# EAGLE board Kopie von JKW_standalone (EAGLE 5.10)
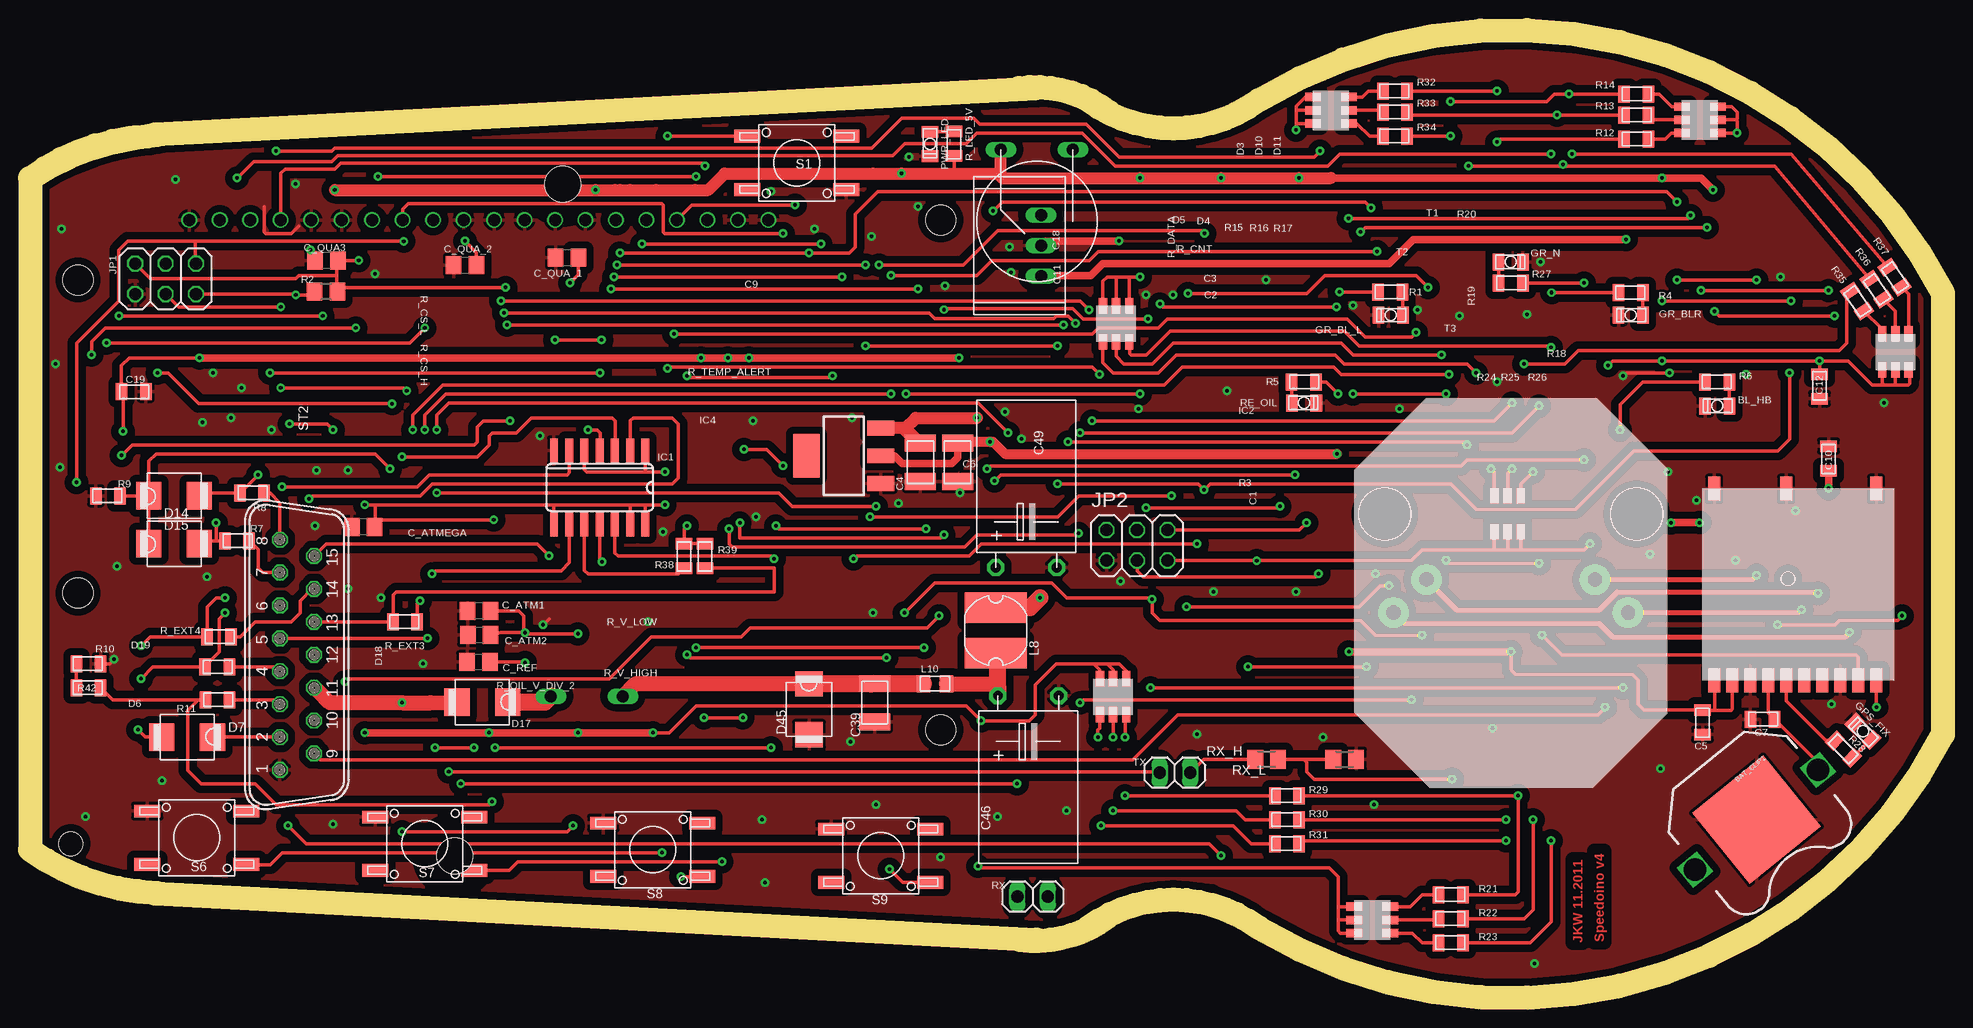
[diagram p2: board, top side]
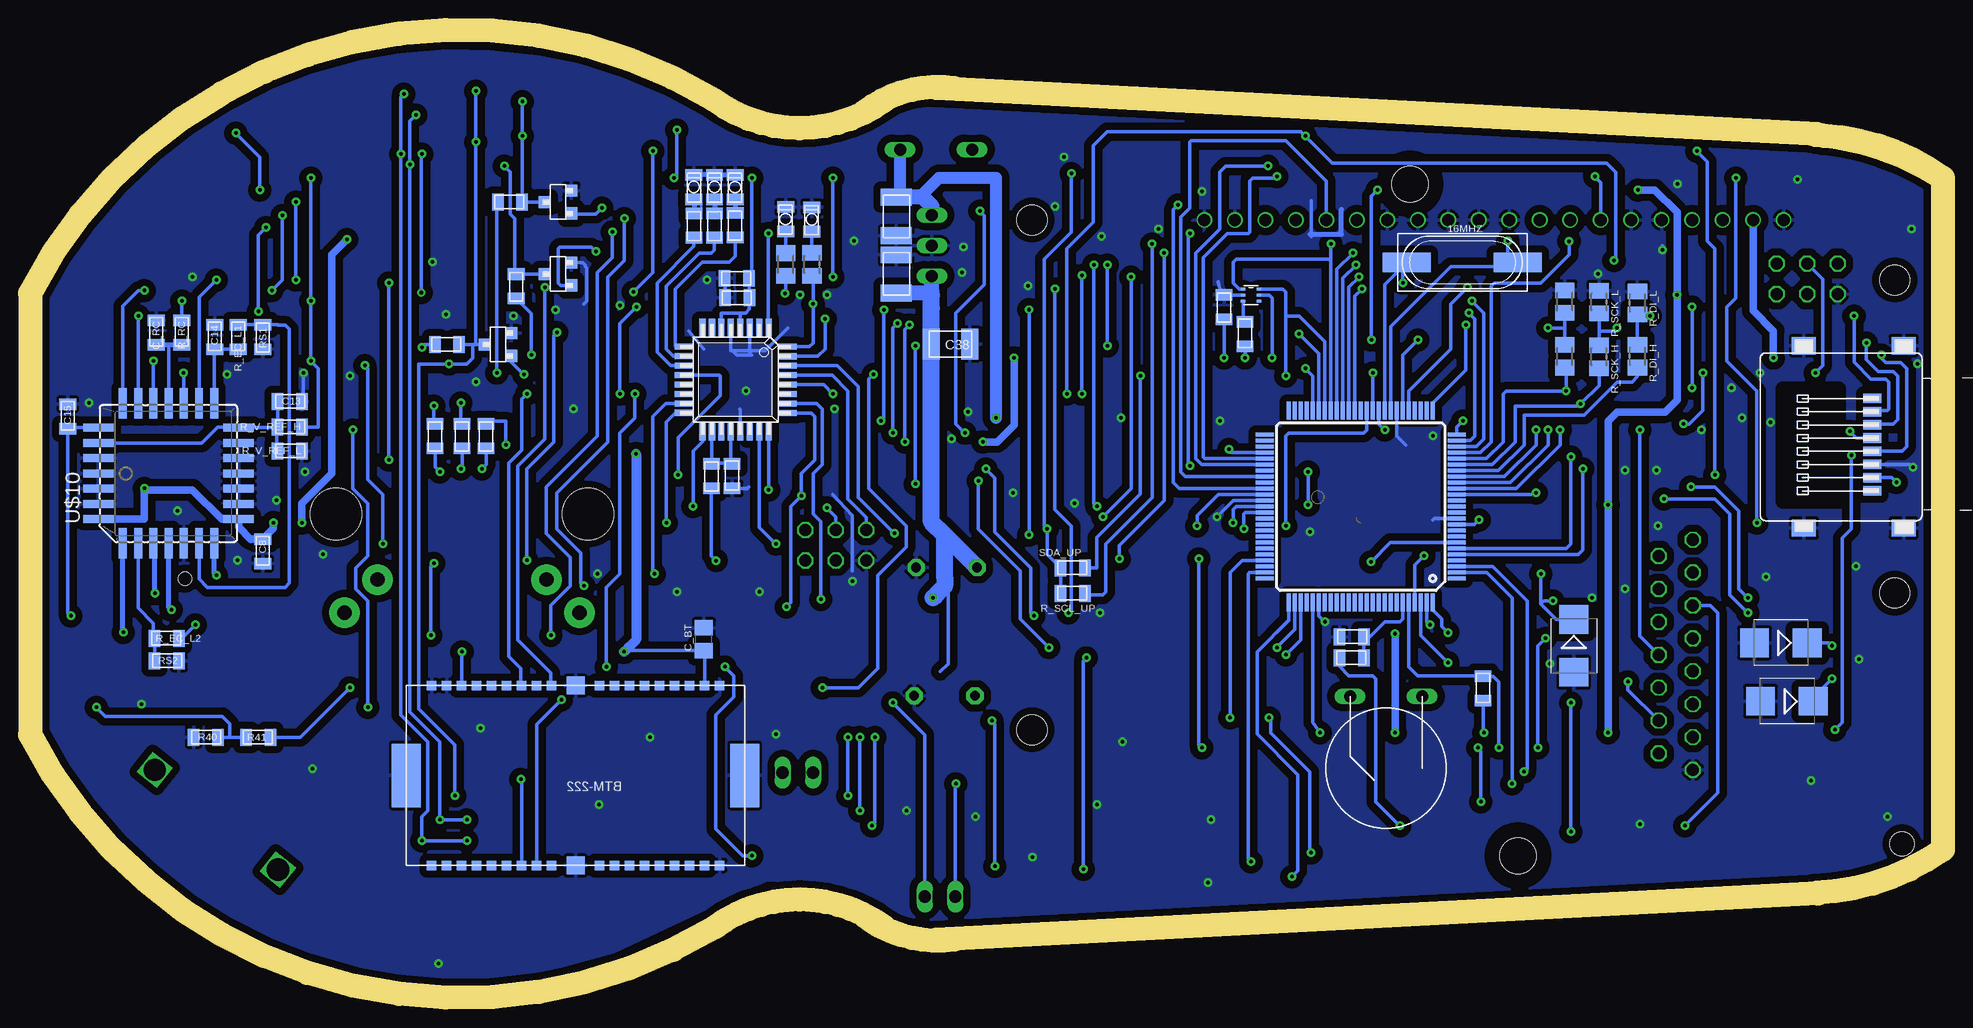
[diagram p3: board, bottom side, seen from below]

Size 159.4 x 80.69 mm. Coordinates in mm from the lower left corner, seen from the top.
Outline: 10.4,71.98 83.86,75.83
Outline: 0,68.34 arc-29 10.6,71.94
Outline: 10.4,8.7 83.86,4.85
Outline: 0,68.34 0,12.34 arc33 10.6,8.74
Outline: 0,68.34 arc-33 9.9,71.84
Outline: 82.4,75.84 arc-45 89.9,73.84
Outline: 88.15,74.84 arc73 102.4,74.84 arc-94 159.4,58.74 159.4,21.94 arc-94 102.4,5.84 arc73 88.15,5.84
Outline: 82.4,4.84 arc45 89.9,6.84
Copper layers (1*16): Top 0.035mm / dielectric 1.5mm / Bottom 0.035mm
Design rules "ZWILLING *": minimum track width 0.2mm, minimum drill 8mil, track to track 0.15mm, track to pad 0.15mm, pad to pad 0.15mm, via to via 0.15mm, smd to smd 0mil, copper to edge 0.15mm, drill to drill 0.15mm, minimum pad ring 0.15mm, minimum via ring 0.2mm, stop-mask expansion 0.1mm, vias tented up to drill 0mil, thermal gap 10mil
Net classes: 0 default: width 0.203 mm, drill 0.406 mm, clearance 0.203 mm; 1 power: width 0.61 mm, drill 0.711 mm, clearance 0.203 mm; 2 gnd: width 0.305 mm, drill 0.711 mm, clearance 0.203 mm; 3 usbvcc: width 0.508 mm, drill 0.711 mm, clearance 0.203 mm
Holes 3 mm at -94.6,24.84 -94.1,69.84 35.4,11.84 44.4,67.84
Holes 2 mm at 3.4,12.84
tRestrict: area -97.4,22 to -91.8,27.6; area -96.9,67 to -91.3,72.6; area 32.6,9 to 38.2,14.6; area 41.6,65 to 47.2,70.6
bRestrict: area -96.6,22.8 to -92.6,26.8; area -96.1,67.8 to -92.1,71.8; area 33.4,9.8 to 37.4,13.8; area 42.4,65.8 to 46.4,69.8

## Footprints (pad centres in the part's own frame; a part is rotated, then mirrored left to right if it is on the bottom)
POLY_FUSE = drill 1 long: P$1 -3,0; P$2 3,0
XT-HC49S-SMD = smd 4 x 1.6: 1 -4.617,0; 2 4.617,0
RGB_LED = smd 1.3 x 0.7: B+ 0,0.55; B- 3,0.55; G+ 0,1.65; G- 3,1.65; R+ 0,2.75; R- 3,2.75
BATTCON_12MM_PTH = smd 7.62 x 7.62: GND 0,0 | drill 1.854 square: VCC@1 -6.604,0; VCC@2 6.604,0
LED-0805 = smd 0.965 x 1.397: 1 -1.016,0; 2 1.016,0
BTM-222 = smd 0.8 x 0.8: P$1 -12.635,-7.5; P$2 -11.385,-7.5; P$3 -10.135,-7.5; P$4 -8.885,-7.5; P$5 -7.635,-7.5; P$6 -6.385,-7.5; P$7 -5.135,-7.5; P$8 -3.885,-7.5; P$9 -2.635,-7.5; P$11 1.365,-7.5; P$12 2.615,-7.5; P$13 3.865,-7.5; P$14 5.115,-7.5; P$15 6.365,-7.5; P$16 7.615,-7.5; P$17 8.865,-7.5; P$18 10.115,-7.5; P$19 11.365,-7.5; P$20 11.365,7.5; P$21 10.115,7.5; P$22 8.865,7.5; P$23 7.615,7.5; P$24 6.365,7.5; P$25 5.115,7.5; P$26 3.865,7.5; P$27 2.615,7.5; P$28 1.365,7.5; P$30 -2.635,7.5; P$31 -3.885,7.5; P$32 -5.135,7.5; P$33 -6.385,7.5; P$34 -7.635,7.5; P$35 -8.885,7.5; P$36 -10.135,7.5; P$37 -11.385,7.5; P$38 -12.635,7.5 | smd 1.5 x 1.5: P$10 -0.635,-7.5; P$29 -0.635,7.5 | smd 2.4 x 5.3: P$AGND -14.735,0; P$BGND 13.465,0
0805 = smd 0.965 x 1.397: 1 -1.016,0; 2 1.016,0
1210 = smd 1.397 x 2.591: 1 -1.6,0; 2 1.6,0
EL-5-8X13R = drill 0.8 pad 1.422 octagon: 1 0,2.54; 2 0,-2.54
EL-5-8X13 = drill 0.8 pad 1.422 octagon: 1 0,-2.54; 2 0,2.54
C0805 = smd 1.3 x 1.5: 1 -0.95,0; 2 0.95,0
SMB = smd 2.4 x 2.4: A 2.2,0; C -2.2,0
SMB' = smd 2.1 x 2.3: A -2.114,0; K 2.114,0
SOT223 = smd 1.219 x 2.235: 1 -2.311,-3.099; 2 0,-3.099; 3 2.311,-3.099 | smd 3.6 x 2.2: 4 0,3.099
MT3329 = smd 2 x 1: 3D-FIX -8.5,0.15; D+ -8.5,-1.35; D- -8.5,-2.85; EN -8.5,4.65; GND -8.5,3.15; GND2 -8.5,-4.35; GND_3 7.5,6.15; GND_4 7.5,0.15; GND_5 7.5,-7.35; RXD -8.5,-7.35; TXD -8.5,-5.85; VBACKUP -8.5,1.65; VCC -8.5,6.15 | hole 1.1: 0,0
SO14 = smd 0.66 x 2.032: 1 -3.81,-3.073; 2 -2.54,-3.073; 3 -1.27,-3.073; 4 0,-3.073; 5 1.27,-3.073; 6 2.54,-3.073; 7 3.81,-3.073; 8 3.81,3.073; 9 2.54,3.073; 10 1.27,3.073; 11 0,3.073; 12 -1.27,3.073; 13 -2.54,3.073; 14 -3.81,3.073
TQFP-32_7X7 = smd 0.508 x 1.5: 1 -2.756,-4.331; 2 -1.968,-4.331; 3 -1.181,-4.331; 4 -0.394,-4.331; 5 0.394,-4.331; 6 1.181,-4.331; 7 1.968,-4.331; 8 2.756,-4.331; 17 2.756,4.331; 18 1.968,4.331; 19 1.181,4.331; 20 0.394,4.331; 21 -0.394,4.331; 22 -1.181,4.331; 23 -1.968,4.331; 24 -2.756,4.331 | smd 1.5 x 0.508: 9 4.331,-2.756; 10 4.331,-1.968; 11 4.331,-1.181; 12 4.331,-0.394; 13 4.331,0.394; 14 4.331,1.181; 15 4.331,1.968; 16 4.331,2.756; 25 -4.331,2.768; 26 -4.331,1.981; 27 -4.331,1.194; 28 -4.331,0.406; 29 -4.331,-0.381; 30 -4.331,-1.169; 31 -4.331,-1.956; 32 -4.331,-2.756
TQFP100 = smd 1.5 x 0.35: 1 -8,6; 2 -8,5.5; 3 -8,5; 4 -8,4.5; 5 -8,4; 6 -8,3.5; 7 -8,3; 8 -8,2.5; 9 -8,2; 10 -8,1.5; 11 -8,1; 12 -8,0.5; 13 -8,0; 14 -8,-0.5; 15 -8,-1; 16 -8,-1.5; 17 -8,-2; 18 -8,-2.5; 19 -8,-3; 20 -8,-3.5; 21 -8,-4; 22 -8,-4.5; 23 -8,-5; 24 -8,-5.5; 25 -8,-6; 51 8,-6; 52 8,-5.5; 53 8,-5; 54 8,-4.5; 55 8,-4; 56 8,-3.5; 57 8,-3; 58 8,-2.5; 59 8,-2; 60 8,-1.5; 61 8,-1; 62 8,-0.5; 63 8,0; 64 8,0.5; 65 8,1; 66 8,1.5; 67 8,2; 68 8,2.5; 69 8,3; 70 8,3.5; 71 8,4; 72 8,4.5; 73 8,5; 74 8,5.5; 75 8,6 | smd 0.35 x 1.5: 26 -6,-8; 27 -5.5,-8; 28 -5,-8; 29 -4.5,-8; 30 -4,-8; 31 -3.5,-8; 32 -3,-8; 33 -2.5,-8; 34 -2,-8; 35 -1.5,-8; 36 -1,-8; 37 -0.5,-8; 38 0,-8; 39 0.5,-8; 40 1,-8; 41 1.5,-8; 42 2,-8; 43 2.5,-8; 44 3,-8; 45 3.5,-8; 46 4,-8; 47 4.5,-8; 48 5,-8; 49 5.5,-8; 50 6,-8; 76 6,8; 77 5.5,8; 78 5,8; 79 4.5,8; 80 4,8; 81 3.5,8; 82 3,8; 83 2.5,8; 84 2,8; 85 1.5,8; 86 1,8; 87 0.5,8; 88 0,8; 89 -0.5,8; 90 -1,8; 91 -1.5,8; 92 -2,8; 93 -2.5,8; 94 -3,8; 95 -3.5,8; 96 -4,8; 97 -4.5,8; 98 -5,8; 99 -5.5,8; 100 -6,8
2X03 = drill 1.016 octagon: 1 -2.54,-1.27; 2 -2.54,1.27; 3 0,-1.27; 4 0,1.27; 5 2.54,-1.27; 6 2.54,1.27
L-PD54 = smd 2.54 x 5.2: 1 -1.905,0; 2 1.905,0
0805+603 = smd 1.11 x 1.43: 1 -0.953,0; 2 0.953,0
NHD_2.7 = drill 1 round: P$1 -110.13,24.5; P$2 -107.59,24.5; P$3 -105.05,24.5; P$4 -102.51,24.5; P$5 -99.97,24.5; P$6 -97.43,24.5; P$7 -94.89,24.5; P$8 -92.35,24.5; P$9 -89.81,24.5; P$10 -87.27,24.5; P$11 -84.73,24.5; P$12 -82.19,24.5; P$13 -79.65,24.5; P$14 -77.11,24.5; P$15 -74.57,24.5; P$16 -72.03,24.5; P$17 -69.49,24.5; P$18 -66.95,24.5; P$19 -64.41,24.5; P$20 -61.87,24.5 | hole 2.5: -119.4,19.5; -119.4,-6.6; -47.5,-18; -47.5,24.5
R0805 = smd 1.3 x 1.5: 1 -0.95,0; 2 0.95,0
M0805 = smd 1.3 x 1.6: 1 -0.95,0; 2 0.95,0
1X02 = drill 1.016 long: 1 -1.27,0; 2 1.27,0
SW-ECO = smd 2.184 x 1.067: 1 -4.128,2.223; 2 -4.128,-2.223; 3 4.128,2.223; 4 4.128,-2.223
SD_MICRO = smd 0.8 x 1.5: 1 3.2,-9.35; 2 2.1,-9.35; 3 1,-9.35; 4 -0.1,-9.35; 5 -1.2,-9.35; 6 -2.3,-9.35; 7 -3.4,-9.35; 8 -4.5,-9.35 | smd 1.45 x 2: GND 7.6,-11.95; GND2 7.6,-3.65; GND3 -7.6,-11.95; GND4 -7.6,-3.65
SOT-23 = smd 1.016 x 1.016: 1 0.953,1.111; 2 -0.952,1.111; 3 0,-1.111
SOT563 = smd 0.25 x 0.4: 1 -0.5,-0.66; 2 0,-0.66; 3 0.5,-0.66; 4 0.5,0.66; 5 0,0.66; 6 -0.5,0.67
SIP3 = drill 1 long: GND 5.75,2; IN 3.21,2; OUT 8.29,2
STEPPER = drill 1.2 pad 2.54 round: 1+ 5.47,7.03; 1- 8.23,9.785; 2+ 8.23,-9.785; 2- 5.47,-7.03 | hole 4.3: 0,10.5; 0,-10.5
PLCC28 = smd 0.66 x 2.54: 1 0,4.572; 2 -1.27,4.572; 3 -2.54,4.572; 4 -3.81,4.572; 12 -3.81,-7.112; 13 -2.54,-7.112; 14 -1.27,-7.112; 15 0,-7.112; 16 1.27,-7.112; 17 2.54,-7.112; 18 3.81,-7.112; 26 3.81,4.572; 27 2.54,4.572; 28 1.27,4.572 | smd 2.54 x 0.66: 5 -5.842,2.54; 6 -5.842,1.27; 7 -5.842,0; 8 -5.842,-1.27; 9 -5.842,-2.54; 10 -5.842,-3.81; 11 -5.842,-5.08; 19 5.842,-5.08; 20 5.842,-3.81; 21 5.842,-2.54; 22 5.842,-1.27; 23 5.842,0; 24 5.842,1.27; 25 5.842,2.54
IP67-SUB-D = drill 1.016 octagon: 1 -9.601,1.422; 2 -6.858,1.422; 3 -4.115,1.422; 4 -1.372,1.422; 5 1.372,1.422; 6 4.115,1.422; 7 6.858,1.422; 8 9.601,1.422; 9 -8.23,-1.422; 10 -5.486,-1.422; 11 -2.743,-1.422; 12 0,-1.422; 13 2.743,-1.422; 14 5.486,-1.422; 15 8.23,-1.422

## Placement (x,y rotation side)
5V_F  600mA  [POLY_FUSE]  83.9,70.72 180 top
12V_F1  1.1A  [POLY_FUSE]  46.4,25.14 180 bottom
16MHZ  16Mhz  [XT-HC49S-SMD]  40.04,61.31 0 bottom
18632422  RGB_LED  [RGB_LED]  88.85,57.69 270 top
BAT_CLIP1  F_908642  [BATTCON_12MM_PTH]  143.88,14.84 219 top
BL_HB  HighB _ 645-598-8191-107F  [LED-0805]  140.6,49.34 180 top
BLUETOOTH  BTM-222  [BTM-222]  114.57,18.53 180 bottom
C1  100nF  [0805]  100.9,43.49 270 bottom
C2  100nF  [0805]  100.46,58.36 0 bottom
C3  100nF  [0805]  100.5,59.98 0 bottom
C4  100n/20V  [1210]  74.2,44.64 90 top
C5  100nF  [0805]  139.38,22.97 90 top
C6  10u/20V  [1210]  77.3,44.64 90 top
C7  100nF  [0805]  144.38,23.22 180 top
C8  100nF  [0805]  140,37.22 270 bottom
C9  100nF  [0805]  59.9,57.59 90 bottom
C10  10µF  [0805]  149.88,44.97 90 top
C11  100n/20V  [1210]  87.2,60.34 90 bottom
C12  100nF  [0805]  149.12,50.97 270 top
C13  100nF  [0805]  137.75,49.72 180 bottom
C14  820pF  [0805]  144,55.09 270 bottom
C15  820pF  [0805]  156.25,48.47 270 bottom
C18  100n/20V  [1210]  87.2,65.14 270 bottom
C19  100n  [0805]  8.64,50.53 180 top
C38  2µ2/100V  [1210]  82.69,54.5 180 bottom
C39  2µ2/100V  [1210]  70.39,24.59 270 top
C46  470µ  [EL-5-8X13R]  83.19,25.17 90 top
C49  470µ  [EL-5-8X13]  83.02,35.87 270 top
C_ATM1  100nF  [C0805]  37.42,32.26 180 top
C_ATM2  100nF  [C0805]  37.44,30.23 180 top
C_ATMEGA  100nF  [C0805]  27.77,39.24 180 top
C_BT  200nF  [C0805]  103.25,29.89 90 bottom
C_QUA3  22pF  [C0805]  24.7,61.46 180 top
C_QUA_1  22pF  [C0805]  44.75,61.72 0 top
C_QUA_2  22pF  [C0805]  36.25,61.09 0 top
C_RC  2700pF  [0805]  148.88,55.47 270 bottom
C_REF  100nF  [C0805]  37.37,27.98 180 top
D3  [LED-0805]  100.64,67.58 90 bottom
D4  Red  [LED-0805]  96.43,64.91 90 bottom
D5  Blue  [LED-0805]  94.26,64.89 90 bottom
D6  20V-Zdiode  [SMB]  12.99,24.72 180 bottom
D7  SS24  [SMB']  13.1,21.74 0 top
D10  [LED-0805]  102.36,67.59 90 bottom
D11  [LED-0805]  104.08,67.59 90 bottom
D14  SS24  [SMB']  12,41.84 180 top
D15  SS24  [SMB']  12,37.84 180 top
D17  SS24  [SMB']  37.7,24.64 0 top
D18  20V-ZD.  [SMB]  30.75,29.34 270 bottom
D19  20V-ZD.  [SMB]  13.5,29.59 180 bottom
D45  SM6T30V  [SMB']  64.92,24.04 90 top
DCDC53.3  AP1117E33G  [SOT223]  67.81,45.18 90 top
GPS  MT3329  [MT3329]  146.5,34.94 90 top
GPS_FIX  Red  [LED-0805]  152.75,22.22 135 top
GR_BL_L  BL_L  [LED-0805]  113.4,56.91 180 top
GR_BLR  BL_R  [LED-0805]  133.4,56.91 180 top
GR_N  N _ M 645-598-8110-107F  [LED-0805]  123.4,61.34 0 top
IC1  4093D  [SO14]  47.47,42.54 180 top
IC2  AT-MEGA-8  [TQFP-32_7X7]  100.6,51.52 180 bottom
IC4  ATMEGA2560-16AU  [TQFP100]  48.5,40.95 180 bottom
JP1  ICSP  [2X03]  11.3,59.94 0 top
JP2  ICSP  [2X03]  92.25,37.72 0 top
L8  22µH 1A  [L-PD54]  80.48,30.62 90 top
L10  BLM21PG221SN1  [0805+603]  75.42,26.17 0 top
NHD_2.7  NHD_2.7  [NHD_2.7]  123.4,40.34 0 top
PWR_LED  Red  [LED-0805]  75,71.18 270 top
R1  250R  [0805]  113.35,58.84 0 top
R2  10K  [R0805]  24.67,58.88 180 top
R3  10R  [0805]  102.6,43.49 90 bottom
R4  250R  [0805]  133.4,58.79 0 top
R5  565R  [0805]  106.15,51.34 180 top
R6  490R  [0805]  140.6,51.34 0 top
R7  310R  [0805]  17.25,38.09 180 top
R8  310R  [0805]  18.5,42.09 180 top
R9  10k  [0805]  6.5,41.84 0 top
R10  5k  [0805]  4.88,27.84 0 top
R11  7k  [0805]  15.62,24.84 180 top
R12  100R  [0805]  133.85,71.59 180 top
R13  90R  [0805]  133.85,73.59 180 top
R14  90R  [0805]  133.85,75.34 180 top
R15  1k  [0805]  100.64,64.42 90 bottom
R16  1k  [0805]  102.35,64.39 90 bottom
R17  1k  [0805]  104.07,64.39 90 bottom
R18  100R  [0805]  124.65,54.47 0 bottom
R19  90R  [0805]  118.88,59.32 90 bottom
R20  90R  [0805]  119.4,66.34 0 bottom
R21  100R  [0805]  118.4,8.59 0 top
R22  90R  [0805]  118.4,6.59 0 top
R23  90R  [0805]  118.4,4.59 0 top
R24  100R  [0805]  121.4,46.84 90 bottom
R25  90R  [0805]  123.4,46.84 90 bottom
R26  90R  [0805]  125.65,46.84 90 bottom
R27  560R  [0805]  123.4,59.59 180 top
R28  1k  [0805]  151.12,20.72 315 top
R29  100R  [0805]  104.75,16.84 0 top
R30  90R  [0805]  104.75,14.84 0 top
R31  90R  [0805]  104.75,12.84 0 top
R32  100R  [0805]  113.75,75.59 0 top
R33  90R  [0805]  113.75,73.84 0 top
R34  90R  [0805]  113.75,71.84 0 top
R35  100R  [0805]  152.25,58.09 125 top
R36  90R  [0805]  153.88,59.09 125 top
R37  90R  [0805]  155.38,60.09 125 top
R38  0R  [0805]  54.5,36.84 90 top
R39  n.b.  [0805]  56.25,36.84 90 top
R40  2k7  [0805]  144.75,21.72 180 bottom
R41  1k2  [0805]  140.38,21.72 0 bottom
R42  0R / n.b.  [0805]  4.88,25.84 0 top
R_CNT  220R  [M0805]  94.24,61.15 270 bottom
R_CS_H  1k2  [M0805]  31.5,53.49 270 bottom
R_CS_L  2k7  [M0805]  31.5,58.04 270 bottom
R_DATA  220R  [M0805]  96.43,61.13 270 bottom
R_DI_H  1k2  [M0805]  25.45,53.49 270 bottom
R_DI_L  2k7  [M0805]  25.45,57.94 270 bottom
R_DZ_DIV1  5k  [0805]  15.61,27.58 180 top
R_EC_L1  1k  [0805]  142.05,55.09 270 bottom
R_EC_L2  1k  [0805]  148,29.97 0 bottom
R_EXT3  5k  [0805]  31.25,31.34 0 top
R_EXT4  5k  [0805]  15.75,30.09 180 top
R_LED_5V  1k  [0805]  77,71.22 90 top
R_OIL_V_DIV_2  220  [0805]  38.31,25.79 270 bottom
R_RC  20k  [0805]  146.75,55.47 270 bottom
R_SCK_H  1k2  [M0805]  28.65,53.44 270 bottom
R_SCK_L  2k7  [M0805]  28.65,58 270 bottom
R_SCL_UP  10K  [0805]  72.5,33.72 0 bottom
R_TEMP_ALERT  1k  [0805]  58.15,55.34 270 bottom
R_V_HIGH  2k  [0805]  49.25,28.34 0 bottom
R_V_LOW  1k  [0805]  49.25,30.09 180 bottom
R_V_REF_H  82k  [0805]  137.75,47.59 180 bottom
R_V_REF_L  10k  [0805]  137.75,45.59 180 bottom
RE_OIL  OIL M 645-598-8110-107F  [LED-0805]  106.17,49.59 0 top
RS1  15,5R  [0805]  140,55.09 90 bottom
RS2  15,5R  [0805]  148,28.09 180 bottom
RX  [1X02]  83.56,8.44 0 top
RX_H  1k2  [M0805]  103.06,19.88 0 top
RX_L  2k7  [M0805]  109.56,19.88 180 top
S1  [SW-ECO]  63.91,69.6 180 top
S6  U  [SW-ECO]  13.9,13.34 0 top
S7  R  [SW-ECO]  32.9,12.84 0 top
S8  D  [SW-ECO]  51.9,12.34 0 top
S9  L  [SW-ECO]  70.9,11.84 0 top
SDA_UP  10K  [0805]  72.5,35.84 0 bottom
ST2  SD_MICRO  [SD_MICRO]  15.22,46.76 90 bottom
T1  Farnell: 1299313  [SOT-23]  115.4,66.34 270 bottom
T2  Farnell: 1299313  [SOT-23]  115.4,60.34 270 bottom
T3  Farnell: 1299313  [SOT-23]  120.4,54.47 270 bottom
TMP102AIDRLT  TMP102  [SOT563]  57.65,58.59 270 bottom
TX  [1X02]  95.42,18.77 180 top
U$2  R-7805-1.0  [SIP3]  86.25,56.97 90 top
U$3  STEPPER  [STEPPER]  123.4,40.34 270 top
U$10  NJM3773FM2  [PLCC28]  149.12,43.72 90 bottom
U$14  RGB_LED  [RGB_LED]  157.1,52.34 90 top
U$15  RGB_LED  [RGB_LED]  140.65,74.84 180 top
U$16  RGB_LED  [RGB_LED]  106.9,72.34 0 top
U$18  RGB_LED  [RGB_LED]  88.6,26.59 270 top
U$19  RGB_LED  [RGB_LED]  110.35,4.84 0 top
U$20  RGB_LED  [RGB_LED]  124.78,38.84 90 top
X2  [IP67-SUB-D]  22.25,28.59 90 top

## Tracks (layer width: path | path; a pad name or v marks a point on that pad's centre or on a via)
12V  (via drill 0.3)
  Top 0.305: v45.25,14.34 44.75,13.84 v31,13.84
  Top 1.27: X2.11 24,25.59 24.99,24.6 v31,24.6 33.38,24.6 D17.A
  Bottom 0.305: R_V_HIGH.1 50.27,27.61 49.5,26.84 47.5,26.84 47.25,26.59 47.25,16.34 v45.25,14.34 | v31,13.84 v31,24.6
12V_SAFE
  Top 1.27: D45.K 50.41,26.16 12V_F1.P$2
  Top 1.422: L10.1 70.41,26.17 C39.1 70.1,26.16 D45.K
+3V3_EXT  (via drill 0.3)
  Top 0.305: C19.2 7.5,50.66 | 140.38,23.97 140.38,26.04 GPS.VCC | GPS.EN 141.85,24.07 141.75,23.97 140.38,23.97 | 140.38,23.97 139.39,23.97 C5.2 134.48,23.98 134,24.47 134,26.47 133.5,26.97 123.81,26.97 123.44,27.34 123.44,28.81 v123.4,28.84 | v7.75,47.22 7.75,50.41 C19.2 | C19.2 7.62,52.72 8.25,53.34 v14.12,53.34
  Top 0.61: DCDC53.3.2 72.06,45.18 72.7,44.54 76.8,44.54 77.3,45.04 C6.2 79.9,46.24 v80,46.34 | v109.9,28.84 v123.4,28.84 | v77.4,53.34 v59.9,53.34 v58.15,53.34 v55.9,53.34 v14.12,53.34
  Top 0.813: v108.9,45.34 81.25,45.34 80.25,46.34 v80,46.34 77.4,46.34 C6.2
  Bottom 0.305: 109.53,29.22 109.39,29.09 | BLUETOOTH.P$17 123.44,28.81 v123.4,28.84 | v59.9,53.34 C9.1 | TMP102AIDRLT.5 56.15,58.59 55.9,58.34 v55.9,53.34 | v58.15,53.34 R_TEMP_ALERT.2 | BLUETOOTH.P$2 103.19,28.88 C_BT.1 109.8,28.94 v109.9,28.84 | ST2.4 7.2,46.66 v7.75,47.22
  Bottom 0.61: v77.4,53.34 77.4,47.74 78.8,46.34 v80,46.34 | NHD_2.7.P$2 15.81,57.28 14.12,55.59 v14.12,53.34
  Bottom 0.813: v108.9,45.34 108.9,29.84 109.53,29.22 v109.9,28.84
A0  (via drill 0.3)
  Top 0.305: v43.25,36.84 42.25,37.84 24.69,37.84 X2.15
  Bottom 0.305: IC4.97 44,36.09 v43.25,36.84
A1  (via drill 0.3)
  Top 0.305: v37,20.84 v33.75,20.84 | X2.5 v33.12,29.97
  Bottom 0.305: IC4.96 44.5,27.59 43.75,26.84 38.97,26.84 R_OIL_V_DIV_2.1 37.47,26.81 37,26.34 v37,20.84 | v33.75,20.84 33.75,29.34 v33.12,29.97
A2
  Bottom 0.305: IC4.95 45,31.59 45.25,31.34 46.5,31.34 47.75,30.09 R_V_LOW.1 R_V_HIGH.2
ARD_RES_OUT  (via drill 0.3)
  Top 0.305: v27.4,61.46 C_QUA3.1 25.57,61.38 25.57,60.09 | 25.57,59.47 25.57,60.09 | 25.57,59.47 25.57,59.26 25.62,59.21 R2.1 | JP1.2 9.76,60.22 9.76,60.21 10,59.97 22.12,59.97 22.38,60.22 25.45,60.22 25.57,60.09 | v39.62,59.22 25.82,59.22 25.57,59.47 | 59.12,71.83 56.02,71.83 56,71.84 | 59.12,71.83 S1.4 | v53.12,71.84 59.11,71.84 59.12,71.83 | v73,50.34 v92.5,50.34
  Bottom 0.305: 27.27,61.59 v27.4,61.46 27.25,61.61 27.25,68.84 28,69.59 50.88,69.59 v53.12,71.84 53.5,72.22 69.62,72.22 70.81,71.04 70.81,64.66 73,62.47 v73,50.34 | IC4.30 44.5,50.59 41,54.09 41,57.84 v39.62,59.22 | IC2.28 93.27,51.12 v92.5,50.34
ARD_RX_5
  Top 0.305: RX_H.1 97.8,19.88 TX.1
ARD_RX_33  (via drill 0.3)
  Top 0.305: RX_H.2 106.12,19.88 | v118.5,18.22 107,18.22 106.38,18.84 106.38,19.63 106.12,19.88 | 106.12,19.88 RX_L.2
  Bottom 0.305: BLUETOOTH.P$26 118.44,18.15 v118.5,18.22
BAT+  (via drill 0.3)
  Top 0.305: U$2.IN 84.29,60.22
  Top 0.61: 84.29,60.22 88.38,60.22 89.38,61.22 113.25,61.22 115.25,63.22 v133,63.22 | v136.75,39.59 136.77,39.61 v139.12,39.61 | v149.88,42.47 C10.1
  Top 1.422: L8.2 83.33,32.53 v84.15,33.34
  Bottom 0.305: 83.76,33.73 83.97,33.52 | 83.53,27.19 82.88,27.84 82.88,34.79 83.17,35.09
  Bottom 0.61: U$10.4 149.88,39.91 v149.88,42.47 149.75,42.34 145.88,42.34 143.44,39.91 U$10.12 142.01,39.23 141,38.22 140.98,38.23 C8.1 139.12,39.11 v139.12,39.61 | v133,63.22 134.25,61.97 134.25,43.72 136.75,41.22 v136.75,39.59
  Bottom 1.27: 84.25,58.84 84.25,57.51 84.29,57.47 | 84.25,58.84 U$2.IN | C11.1 84.35,58.74 84.25,58.84
  Bottom 1.422: 84.29,58.55 84.29,57.47 C38.2 84.29,39.68 83.17,38.57 | 83.17,38.57 C49.1 | v84.15,33.34 83.76,33.73 83.17,34.32 83.17,35.09 83.17,38.57 | C11.1
BL_L
  Top 0.305: X2.8 20.83,41.27 20,42.09 R8.1
BL_R
  Top 0.305: X2.7 19.39,35.45 19,35.84 19,37.36 R7.1
BLUE_INSTR  (via drill 0.3)
  Top 0.305: R23.2 125,4.59 126.75,6.34 v126.75,13.09 | v123,13.09 106.02,13.09 R31.2 | R14.2 v128.25,75.34 127,75.34 126.38,74.72 v118.38,74.72 | v118.38,71.84 R34.2 | v128.5,70.34 146.75,70.34 R37.2 154.79,61.18
  Bottom 0.305: v123,13.09 v126.75,13.09 126.75,15.09 126.25,15.59 126.25,21.34 128.5,23.59 v128.5,70.34 128.5,75.09 v128.25,75.34 | T1.3 R20.2 118.38,67.21 v118.38,71.84 v118.38,74.72
CONNECT  (via drill 0.3)
  Top 0.305: v94.15,57.84 94.4,57.59 v108.88,57.59 | v118,50.34 v110.25,50.34
  Bottom 0.305: IC2.32 94.46,54.28 94.15,54.59 v94.15,57.84 94.15,60.12 R_CNT.2 | v118,50.34 118.44,49.91 118.44,45.66 119.5,44.59 119.5,28.47 118.5,27.47 118.5,26.1 BLUETOOTH.P$13 | v110.25,50.34 110.25,56.22 v108.88,57.59
D2  (via drill 0.3)
  Top 0.305: v31,45.09 37.25,45.09 38.25,46.09 38.25,46.84 38.5,47.09 40.5,47.09 41.75,48.34 48.5,48.34 48.75,48.09 IC1.3
  Top 0.406: IC1.3
  Bottom 0.305: IC4.6 31.39,37.45 31,37.84 v31,45.09
D3  (via drill 0.3)
  Top 0.305: v47.65,36.34 47.47,36.59 IC1.11
  Bottom 0.305: IC4.7 46.04,37.95 v47.65,36.34
D5  (via drill 0.3)
  Top 0.305: D14.K D15.K | D14.K R9.2 | D14.K 9.89,44.73 10.5,45.34 28.75,45.34 v30,44.09
  Bottom 0.305: v30,44.09 30,37.34 30.39,36.95 IC4.5
D6  (via drill 0.3)
  Top 0.305: v33.9,42.09 62.4,42.09 63.52,40.97 v70.5,40.97 | v70.75,61.09 77.75,61.09 80.62,63.97 97.62,63.97 v97.88,63.72
  Bottom 0.305: 97.9,55.91 IC2.1 97.9,55.8 97.9,55.34 97.88,55.37 v97.88,63.72 | v33.9,42.09 34.29,41.95 IC4.15 | v70.5,40.97 70.75,41.22 v70.75,61.09
D7  (via drill 0.3)
  Top 0.305: v31.9,47.34 31.9,48.59 34.4,51.09 94.5,51.09 96,52.59 108.62,52.59 109.25,51.97 v118.25,51.97
  Bottom 0.305: IC4.16 35.54,42.45 31.9,46.09 v31.9,47.34 | v118.25,51.97 119.29,53.01 T3.1
D8  (via drill 0.3)
  Top 0.305: v32.9,47.34 32.9,48.59 34.65,50.34 v71.75,50.34 | v112.25,62.22 89,62.22 88.25,61.47 80.12,61.47 78.88,60.22 v71.75,60.22
  Bottom 0.305: IC4.17 36.04,42.95 32.9,46.09 v32.9,47.34 | v71.75,50.34 v71.75,60.22 | T2.1 115.17,59.39 115.38,59.59 115.38,62.47 115.25,62.59 112.62,62.59 v112.25,62.22
D9  (via drill 0.3)
  Top 0.305: v33.9,47.34 33.9,48.59 34.9,49.59 79,49.59 v81.5,47.09 | v80.25,65.59 81,66.34 111.25,66.34 v111.75,65.84
  Bottom 0.305: IC4.18 36.54,43.45 33.9,46.09 v33.9,47.34 | v80.25,65.59 79.88,65.22 79.88,59.47 82.25,57.09 82.25,47.84 v81.5,47.09 | v111.75,65.84 112.25,65.34 114.24,65.34 T1.1
D10  (via drill 0.3)
  Top 0.305: v39.25,58.09 87.5,58.09 v88.25,57.34 | v88.5,48.09 122,48.09 v123.5,49.59
  Bottom 0.305: IC4.23 38.89,45.95 38.25,46.59 38.25,57.09 v39.25,58.09 | R25.2 123.5,47.96 v123.5,49.59 | v88.5,48.09 88.25,48.34 v88.25,57.34
D11  (via drill 0.3)
  Top 0.305: v87.12,56.22 86.5,56.84 85.5,56.84 85.3,56.64 75.38,56.64 74.92,57.09 v39.5,57.09 | v87.5,47.09 123.5,47.09 v125.75,49.34
  Bottom 0.305: IC4.24 39.39,46.45 39,46.84 39,56.59 v39.5,57.09 | v125.75,49.34 125.75,47.96 R26.2 | v87.5,47.09 87.5,55.84 v87.12,56.22
D12  (via drill 0.3)
  Top 0.305: v40,48.09 37.75,48.09 37.25,47.59 37.25,46.34 37,46.09 8.5,46.09 v7.62,45.22 | v9,22.34 9.6,21.74 D7.A
  Bottom 0.305: IC4.25 40.5,47.59 v40,48.09 | v9,22.34 8.38,22.97 8.38,38.34 7.62,39.09 v7.62,45.22
D13  (via drill 0.3)
  Top 0.305: v86.5,46.34 119.5,46.34 v119.75,46.09 | v39.75,56.09 v86.12,56.09
  Bottom 0.305: IC4.26 42.5,49.59 39.75,52.34 v39.75,56.09 | v119.75,46.09 119.75,48.09 121.17,48.09 R24.2 | v86.5,46.34 86.5,55.72 v86.12,56.09
D20  (via drill 0.3)
  Top 0.305: v66.88,51.84 66.75,51.72 54.88,51.72 v54.75,51.84
  Bottom 0.305: IC4.44 51.5,54.72 53.62,56.84 54.75,56.84 | 54.75,56.84 v54.75,51.84 | v66.88,51.84 66.88,41.99 70.5,38.37 70.5,35.84 70.52,35.83 SDA_UP.2 | TMP102AIDRLT.6 55,59.09 54.75,58.84 54.75,56.84
D21  (via drill 0.3)
  Top 0.305: v65.9,62.84 v51,62.84
  Bottom 0.305: v65.9,62.84 65.9,41.72 69.78,37.84 69.78,33.82 70,33.59 71.36,33.59 R_SCL_UP.2 | TMP102AIDRLT.1 58.65,59.09 59.15,59.59 59.12,59.62 59.12,61.34 58.88,61.59 51.25,61.59 arc90 51,61.34 | 51,61.34 IC4.43 | v51,62.84 51,61.34
D22  (via drill 0.3)
  Top 0.305: S9.4 72.72,9.62 v71.62,10.72 | v71.38,28.34 55,28.34 v54.75,28.59
  Bottom 0.305: IC4.78 53.5,29.84 v54.75,28.59 | v71.62,10.72 71.62,28.09 v71.38,28.34
D23  (via drill 0.3)
  Top 0.305: v105.4,43.59 80.88,43.59 v80.38,43.09 | v74.5,29.2 v55.5,29.2
  Bottom 0.305: IC4.77 54,30.7 v55.5,29.2 | v105.4,43.59 105.4,46.72 101.9,50.22 101.9,51.84 101.97,51.92 IC2.12 | v80.38,43.09 80.38,39.09 76.88,35.59 76.88,31.58 v74.5,29.2
D24  (via drill 0.3)
  Top 0.305: v54.25,10.09 56,10.09 S8.4
  Bottom 0.305: IC4.76 54.5,31.45 | 54.5,31.45 55.5,30.45 | 54.5,31.45 54.54,31.45 57.15,28.84 57.15,21.99 53.75,18.59 53.75,10.59 v54.25,10.09 54.15,10.19
D26  (via drill 0.3)
  Top 0.305: v57.65,11.34 40.65,11.34 39.93,10.62 S7.4
  Bottom 0.305: IC4.74 57.79,35.45 57.9,35.34 57.9,11.59 v57.65,11.34
D28  (via drill 0.3)
  Top 0.305: v59.4,23.34 v56.15,23.34 | v52.65,12.09 21,12.09 20,11.09 18.05,11.09 S6.4
  Bottom 0.305: IC4.72 58.4,36.45 59.4,35.45 v59.4,23.34 | v56.15,23.34 56,23.19 56,22.09 52.75,18.84 52.75,12.19 v52.65,12.09
D30  (via drill 0.3)
  Top 0.305: v63.75,66.09 55.15,66.09 NHD_2.7.P$17
  Bottom 0.305: IC4.60 63.61,42.45 64.12,42.97 64.12,65.72 v63.75,66.09
D32
  Bottom 0.305: IC4.58 63.11,43.45 63.5,43.84 63.5,65.09 62.75,65.84 62.75,71.34 62.62,71.47 54.75,71.47 51.38,68.09 51.38,64.86 NHD_2.7.P$16
D34  (via drill 0.3)
  Top 0.305: NHD_2.7.P$4 20.89,68.73 21.25,69.09 25.38,69.09 25.88,69.59 56,69.59 v56.25,69.34
  Bottom 0.305: v56.25,69.34 59.75,69.34 60.25,68.84 60.25,64.09 62.25,62.09 62.25,44.97 61.73,44.45 IC4.56
D35  (via drill 0.3)
  Top 0.305: v55.5,68.47 v29,68.47
  Bottom 0.305: NHD_2.7.P$7 28.51,67.98 v29,68.47 | IC4.55 61.48,44.95 61.62,45.09 61.62,61.72 59.62,63.72 57.88,63.72 57.75,63.84 57.75,68.09 57.5,68.34 55.62,68.34 v55.5,68.47
D36  (via drill 0.3)
  Top 0.305: NHD_2.7.P$8 31.05,65.77 31.5,66.22 52.62,66.22 52.75,66.09 52.75,63.84 52.88,63.72 v62.75,63.72 | v59.5,45.72 61.38,45.72 v62.75,44.34
  Bottom 0.305: v62.75,63.72 62.88,63.72 62.88,44.47 v62.75,44.34 | IC4.54 59.23,45.45 v59.5,45.72
D42  (via drill 0.3)
  Top 0.305: v49.15,62.09 v64.9,62.09 68.25,62.09 68.75,62.59 68.75,65.34 70.62,67.22 136.38,67.22 v137.25,66.34 | v68.62,36.59 68.88,36.84 78.25,36.84 79.25,37.84 v97.25,37.84 | v137.25,59.84 v143.88,59.84
  Bottom 0.305: IC4.42 50.5,60.74 v49.15,62.09 | v64.9,62.09 64.9,41.44 68.62,37.72 v68.62,36.59 | v97.25,37.84 98.62,39.22 IC2.23 | U$10.20 145.31,58.4 v143.88,59.84 | v137.25,66.34 v137.25,59.84
D43  (via drill 0.3)
  Top 0.305: v48.9,61.09 v69.62,61.09 | v69.62,54.34 v85.62,54.34 | v85.62,42.84 97.34,42.84 v97.84,42.34 98.34,42.84 118.38,42.84 120.5,40.72 128.75,40.72 133.62,45.59 145.62,45.59 146.62,46.59 v146.62,52.09
  Bottom 0.305: IC4.41 50,59.99 v48.9,61.09 | v97.84,42.34 IC2.24 | v69.62,61.09 v69.62,54.34 | v85.62,54.34 v85.62,42.84 | U$10.21 146.59,52.05 v146.62,52.09
D44  (via drill 0.3)
  Top 0.305: v48.65,60.09 v67.65,60.09 | v70,40.09 85.62,40.09 87.38,41.84 v95.12,41.84 | v96.38,32.59 110.75,32.59 112.5,34.34 v113.25,34.34 | v139.25,58.97 v149.88,58.97 | v138.38,65.22 138.12,64.97 v109.88,64.97
  Bottom 0.305: IC4.40 49.5,59.24 v48.65,60.09 | IC2.25 94.29,48.75 94,48.47 94,44.84 95.12,43.72 v95.12,41.84 96,40.97 96,32.97 v96.38,32.59 | v67.65,60.09 67.65,42.44 v70,40.09 | v113.25,34.34 113.5,34.59 113.5,37.09 115.5,39.09 115.5,42.09 111.25,46.34 111.25,60.09 109.88,61.47 v109.88,64.97 | U$10.25 151.66,57.68 150.38,58.97 v149.88,58.97 | v139.25,58.97 138.38,59.84 v138.38,65.22
D45  (via drill 0.3)
  Top 0.305: v48.4,59.09 v74,59.09 | v72.88,32.09 75.38,34.59 85.15,34.59 86.4,33.34 93.38,33.34 v93.5,33.22 93.5,32.09 94.12,31.47 110.88,31.47 112.12,30.22 v116,30.22 | v110.88,63.84 111.25,64.22 v139.75,64.22 | v140.38,57.22 140.75,56.84 v150.38,56.84
  Bottom 0.305: IC4.39 49,58.49 v48.4,59.09 | v74,59.09 74,40.69 72.62,39.32 72.62,32.34 v72.88,32.09 | IC2.26 93.82,49.54 93.38,49.09 93.38,44.47 94.12,43.72 94.12,40.34 93.5,39.72 v93.5,33.22 | v116,30.22 116,32.72 114.38,34.34 114.38,36.72 116.38,38.72 116.38,42.59 112.12,46.84 112.12,60.47 110.88,61.72 v110.88,63.84 | v139.75,64.22 140.38,63.59 v140.38,57.22 | v150.38,56.84 150.4,56.82 U$10.24
D47  (via drill 0.3)
  Top 0.305: v54.75,39.34 54.5,39.09 R38.2 R39.2
  Bottom 0.305: IC4.37 48,47.34 48.25,47.09 54.5,47.09 54.75,46.84 v54.75,39.34
D48  (via drill 0.3)
  Top 0.305: v47.5,52.09 v20,52.09 | v21.62,47.84 24.75,47.84 v25.25,47.34
  Bottom 0.305: v47.5,52.09 IC4.36 | v21.62,47.84 21.12,47.84 20,48.97 v20,52.09 | X2.12 25.25,30.17 v25.25,47.34
D49  (via drill 0.3)
  Top 0.305: v46.5,47.34 47.25,47.34 47.5,47.09 47.5,45.64 IC1.4
  Bottom 0.305: IC4.35 47,47.84 v46.5,47.34
D50  (via drill 0.3)
  Top 0.305: 13.75,63.09 8.15,63.09 7.38,62.32 7.38,58.09 3.88,54.59 v3.88,42.97 | 13.75,63.09 31.15,63.09 v31.15,63.07 | JP1.6 13.75,61.3 13.75,63.09
  Bottom 0.305: IC4.22 38.54,45.45 37.65,46.34 37.65,59.32 37.38,59.59 33.5,59.59 31.15,61.94 v31.15,63.07 | ST2.7 4.27,43.36 v3.88,42.97
D51  (via drill 0.3)
  Top 0.305: v20.9,50.84 31.15,50.84 v31.4,50.59 | v20.9,57.59 12.38,57.59 JP1.3
  Bottom 0.305: v20.9,50.84 v20.9,57.59 | IC4.21 38.04,44.95 36.65,46.34 36.65,50.34 36.4,50.59 v31.4,50.59 31.4,52.44 R_CS_H.2
D52  (via drill 0.3)
  Top 0.305: v30.18,49.52 14.07,49.52 11.5,52.09 v10.62,52.09
  Bottom 0.305: R_SCK_H.2 28.65,51.05 v30.18,49.52 30.36,49.34 35.65,49.34 35.65,46.34 37.54,44.45 IC4.20 | JP1.4 10,59.91 10,52.72 v10.62,52.09
D53
  Bottom 0.305: R_DI_H.2 25.45,51.79 25.9,51.34 27.11,51.34 29.86,48.59 34.9,48.59 34.9,46.09 37.04,43.95 IC4.19
DZ  (via drill 0.3)
  Top 0.305: v9.25,26.59 10.24,27.58 R_DZ_DIV1.2 14.59,27.69 15.75,28.84 15.75,31.59 v16.25,32.09 | v23.25,41.59 23.5,41.84 32.5,41.84 33.5,42.84 53.5,42.84 54,43.34 54,47.84 53.5,48.34 50.25,48.34 50.01,48.11 IC1.2
  Bottom 0.305: v16.25,32.09 17.75,33.59 17.75,40.34 19,41.59 v23.25,41.59 | D6.C 10.79,25.05 v9.25,26.59
DZ_IN
  Top 0.305: R_DZ_DIV1.1 20.47,27.58 X2.4
EXTEND1  (via drill 0.3)
  Top 0.305: v9.25,29.34 10,30.09 R_EXT4.2 14.75,30.11 14.75,32.59 15.5,33.34 v16.25,33.34 | IC1.6 44.93,43.78 44.75,43.59 33.25,43.59 32.25,42.59 v21,42.59
  Bottom 0.305: v21,42.59 19,42.59 17,40.59 17,34.09 v16.25,33.34 | D19.C 9.5,29.59 v9.25,29.34
EXTEND2  (via drill 0.3)
  Top 0.305: R_EXT3.2 32.27,32.86 v32.5,33.09 | v33.5,35.34 33.75,35.59 44.25,35.59 44.93,36.28 IC1.9
  Bottom 0.305: v32.5,33.09 33.25,33.09 33.5,32.84 | v33.5,35.34 33.5,32.84 | D18.C 32.2,31.54 33.5,32.84
GND  (via drill 0.3)
  Top 0.305: v42.75,31.09 43.25,31.59 | C6.1 77.3,42.29 v77.5,42.09 | 22.38,64.34 21.75,63.72 19.62,63.72 19.5,63.84 19.5,65.97 | v136.62,52.09 133,52.09 v132.75,51.84 | R10.2 6.62,27.84 v7,28.22 | 23.75,61.97 C_QUA3.2 23.75,61.84 v23.38,62.34 arc-90 23.75,61.97
  Top 0.61: U$2.GND 84.62,63.09 v90.75,63.09
  Bottom 0.305: C9.2 59.88,58.59 TMP102AIDRLT.2 59.25,58.59 arc90 60.38,59.72 | C2.1 101.48,59.94 C3.1 | IC4.81 52,31.84 v51.5,31.34 | IC4.99 43,31.34 v42.75,31.09 | IC4.11 42.39,39.95 42.5,39.84 | IC4.32 45.5,46.84 44.75,46.09 | IC2.21 100.21,49.05 100.25,49.09 | IC2.3 99.42,53.76 99.25,53.59 100.5,53.59 101,54.09 IC2.5 100.99,53.97 101,53.97 98.12,53.97 96.25,55.84 | v23.38,62.34 23.25,62.59 23.38,62.72 | 52.62,63.47 52.62,66.47 | IC4.62 59.14,41.45 v60.5,40.09 | 99.5,42.59 99.62,42.47 C1.2 | 90.88,35.59 90.88,40.22 92.5,41.97 | ST2.6 2.75,44.46 v2.5,44.22 | C13.1 136.62,49.83 v136.62,52.09 | T2.2 113.33,61.3 113.12,61.09 113.12,60.97 113,60.84 113,58.09 113.25,57.84 | 103.25,54.09 104.5,55.59
  Bottom 0.406: D3.2 102.35,68.6 D10.2 D11.2 | 50.12,65.72 50.12,63.64 52.75,63.64
  other vias: 75.88,11.72 125.38,2.84 60.25,48.09 4.62,15.09 25.25,14.47 80.62,15.09 112,16.09 121.88,22.47 107.75,21.72 112.12,35.34 2.62,64.09 12.12,68.22 7.25,35.97 11,18.09 65.38,64.09 68.38,21.34 70.25,32.09 68.5,48.34 72.38,41.22 81.25,48.84 82.62,46.59 16.75,48.34 52.75,38.84 42.5,46.84 76.25,59.34 32.75,27.84 29.25,33.34 114.12,49.09 99.75,50.59 115.62,57.34 145.88,60.09 125.88,61.34 28.75,60.34 14.75,35.09 26.5,34.09 23.75,39.34 73.25,70.09 61.75,67.22 70.5,16.09 15.25,52.09 17.62,50.84 14.38,47.97 2.12,52.84 81.75,60.47 81.62,62.59 61.25,9.59 61,14.84 86.38,15.59 135.88,19.09 122.25,51.34 143,51.97 22.12,67.84 150.12,24.47 110.25,57.72 119.12,56.84 105.5,33.84 124.75,56.97 93,58.59 90.88,34.72 92.38,49.09 98.62,33.84 26.5,43.97 23.88,43.97 20.12,47.34 138.88,41.47 135,36.97 142.12,36.47 147.12,40.59 136.5,43.84 103,59.84 95.25,58.59 74,65.97 70.12,63.47 154.5,49.59 97.25,21.97
  pour Bottom (isolate 0.61): 1.25,13.59 1.25,67.09 2.25,68.09 4.75,69.34 7,70.09 11.5,70.84 36,72.09 84.25,74.59 86,74.34 87.25,73.84 89.25,72.59 91.75,71.59 94,71.09 97.5,71.34 100.5,72.09 103.75,74.09 106.5,75.59 110.75,77.34 115.5,78.59 120.75,79.34 125.75,79.34 130,78.84 135,77.59 139,76.09 142.5,74.34 146.5,71.59 149.75,69.09 153.25,65.59 158,58.34 158,22.34 156,19.09 153,14.84 149.75,11.59 146.25,8.84 141.5,5.84 137.75,4.09 131.75,2.34 126.75,1.59 120.75,1.59 116.25,2.34 110.75,3.84 98,9.84 93.5,9.59 91.5,9.09 88.75,8.09 87,6.84 85.25,6.34 83.25,6.34 10.5,10.09 5.75,11.09 3,12.34 1.5,13.34
  pour Top (isolate 0.61): 1.25,67.09 2,67.84 3.25,68.59 4.75,69.34 8,70.34 11,70.84 14,71.09 36,72.09 84,74.59 85.75,74.34 87.75,73.59 89.75,72.34 92.25,71.59 93.75,71.09 95.25,71.09 97.75,71.34 99.75,71.84 102,72.84 105.25,74.84 107.25,75.84 111.25,77.59 114.25,78.09 117.25,78.84 121,79.34 126.25,79.34 129.25,78.84 133,78.09 136,77.34 138.25,76.34 141,75.09 144,73.34 150,68.84 152.75,66.09 154.5,63.84 156,61.34 158,58.34 158,22.34 156.5,20.09 154,16.09 151,13.09 146.5,9.09 143.75,7.09 137,3.84 131.25,2.09 125.5,1.59 120.25,1.59 115.5,2.59 110.25,3.84 106.5,5.59 102,7.84 98.75,9.59 96,9.84 92,9.34 89.5,8.34 87,6.84 85.75,6.34 82.75,6.34 12.25,10.09 9.5,10.34 7,10.84 4.5,11.59 2.5,12.59 1.75,13.34 1.25,14.09
GREEN_INSTR  (via drill 0.3)
  Top 0.305: R30.2 v123,14.84 | v125.25,14.84 125.25,7.34 124.5,6.59 R22.2 | R33.2 114.75,73.84 115,73.59 v127.25,73.59 R13.2 | v119.88,69.34 127.62,69.34 v127.75,69.47 127.88,69.34 145.38,69.34 R36.2 153.29,60.18
  Bottom 0.305: T2.3 R19.2 119,60.46 119,64.97 119.38,65.34 119.38,68.84 v119.88,69.34 | v123,14.84 v125.25,14.84 125.25,21.34 127.75,23.84 v127.75,69.47 127.75,73.09 v127.25,73.59
HIGH_BEAM  (via drill 0.3)
  Top 0.305: X2.9 24.19,19.84 91.88,19.84 95.62,23.59 130.62,23.59 v131.25,24.22 | R6.1 134.38,51.34 132.5,49.47 v132.5,47.34
  Bottom 0.305: v132.5,47.34 132.5,42.47 131.25,41.22 131.25,36.84 132.25,35.84 132.25,34.09 131.25,33.09 v131.25,24.22
KUPPLUNG_IN
  Top 0.305: X2.2 15.22,21.74 D7.K
MISO_AT8  (via drill 0.3)
  Top 0.305: JP2.6 105.77,38.99 v106.38,39.59
  Bottom 0.305: IC2.16 105.62,48.77 106.38,48.02 v106.38,39.59
MOSI_AT8  (via drill 0.3)
  Top 0.305: JP2.3 92.25,35.59 92.75,35.09 107.12,35.09 v107.38,35.34
  Bottom 0.305: IC2.15 106.44,49.56 107.53,48.47 107.53,40.87 | 107.53,40.87 107.5,40.84 | v107.38,35.34 107.53,35.49 107.53,40.87
N$1
  Top 0.305: 80.65,28.72 L8.1
  Top 1.27: L10.2 80.32,26.17 80.65,25.84
  Top 1.422: C46.1 80.65,25.84 80.65,28.72
N$2  (via drill 0.3)
  Top 0.305: D14.A 14.36,42.09 R8.2 17.5,42.09 v19,43.59 | v107.5,70.59 107,70.09 90.75,70.09 88,72.84 79.12,72.84 78.62,73.34 72.62,73.34 70.12,70.84 25.38,70.84 25.12,70.59 v20.5,70.59 | v109.12,58.84 R1.1
  Bottom 0.305: v19,43.59 19,62.47 19.62,63.09 19.62,69.72 v20.5,70.59 | v107.5,70.59 107.5,60.47 v109.12,58.84
N$3
  Bottom 0.305: C1.1 100.99,44.78 IC2.20 100.99,44.75 101.15,44.59 102.52,44.59 R3.2 102.57,44.54 IC2.18
N$4
  Bottom 0.305: TMP102AIDRLT.3 58.31,56.52 R_TEMP_ALERT.1
N$5
  Bottom 0.305: R_CNT.1 94.24,64.11 D5.1
N$6  (via drill 0.3)
  Top 0.305: v89.25,14.34 100.25,14.34 101.75,12.84 R31.1 | U$18.B- 89.12,23.57 89.12,22.47 88.97,22.32 88.97,21.72 v89,21.72
  Bottom 0.305: v89,21.72 89,14.59 v89.25,14.34
N$7  (via drill 0.3)
  Top 0.305: R30.1 101.25,14.84 100.5,15.59 v90.25,15.59 | v90.25,21.72 U$18.G-
  Bottom 0.305: v90.25,15.59 v90.25,21.72
N$8  (via drill 0.3)
  Top 0.305: v91.25,16.84 R29.1 | v91.25,21.72 91.25,23.49 U$18.R-
  Bottom 0.305: v91.25,16.84 v91.25,21.72
N$9
  Top 0.305: PWR_LED.1 76.97,72.2 R_LED_5V.2
N$10
  Top 0.305: U$16.B- 110.58,72.89 111.62,71.84 R34.1
N$11  (via drill 0.3)
  Top 0.305: 15.5,38.09 14.36,38.09 D15.A | 15.5,38.09 R7.2 | v15.5,39.59 15.5,38.09 | v126.8,58.79 R4.1 | v17.25,68.34 18.62,69.72 25.12,69.72 25.62,70.22 71.88,70.22 72.88,71.22 78,71.22 78.88,72.09 87.7,72.09 90.45,69.34 108.12,69.34 109.12,70.34 v126.75,70.34
  Bottom 0.305: v15.5,39.59 15.5,50.59 18,53.09 18,57.59 17.25,58.34 v17.25,68.34 | v126.8,58.79 126.8,70.29 v126.75,70.34
N$12
  Bottom 0.305: D4.1 R_DATA.1
N$13  (via drill 0.3)
  Top 0.305: v32.9,55.84 31.65,54.59 v6.38,54.59
  Bottom 0.305: 31.5,55.84 R_CS_H.1 | 31.5,55.84 v32.9,55.84 | R_CS_L.2 31.5,55.84 | ST2.3 5.79,47.84 4.12,47.84 3.75,48.22 3.75,51.84 4.12,52.22 5.38,52.22 6.38,53.22 v6.38,54.59
N$14
  Bottom 0.305: R17.1 104.07,62.67 107.15,59.59 107.15,53.84 106.01,52.7 IC2.11
N$15
  Top 0.305: R28.2 153.34,21.5 GPS_FIX.1
N$16
  Top 0.305: GPS.3D-FIX 146.35,24.74 149.66,21.44 R28.1
N$17  (via drill 0.3)
  Top 0.406: U$3.1+ 143.53,34.87 v143.88,35.22
  Bottom 0.406: v143.88,35.22 144.04,35.39 U$10.11
N$18
  Bottom 0.305: IC2.10 105.8,53.49 106.4,54.09 106.4,59.34 103.65,62.09 102.65,62.09 102.4,62.34 102.4,63.33 R16.1
N$19  (via drill 0.3)
  Top 1.016: 72.95,47.49 DCDC53.3.3 | 72.95,47.49 C4.2 74,46.24 72.9,47.34 | v78.9,48.34 73.8,48.34 72.95,47.49
  Bottom 0.305: 85,66.74 85,66.84 85.08,66.92
  Bottom 1.016: v78.9,48.34 78.9,68.34 83.65,68.34 85.08,66.92 85.25,66.74 | 5V_F.P$1 86.9,67.04 C18.1
  Bottom 1.27: U$2.OUT 84.25,65.99 85,66.74 C18.1
N$20
  Bottom 0.305: R15.1 100.64,61.85 101.15,61.34 103.4,61.34 105.65,59.09 105.65,54.34 105.59,54.28 IC2.9
N$21
  Top 0.305: 112.61,73.72 R33.1 112.58,73.99 U$16.G-
N$22
  Top 0.305: U$16.R- 111,75.09 111.5,75.59 R32.1
N$23  (via drill 0.3)
  Top 0.305: v27.15,55.84 6.25,55.84 5.12,54.72 v5.12,53.59
  Bottom 0.305: 28.65,55.59 R_SCK_H.1 | R_SCK_L.2 28.65,55.59 | 28.65,55.59 27.4,55.59 v27.15,55.84 | v5.12,53.59 5.12,53.34 4.75,52.97 3.5,52.97 3,52.47 3,45.97 3.38,45.59 5.84,45.59 ST2.5
N$24
  Top 1.422: D17.K 42.9,24.64 12V_F1.P$1
N$25  (via drill 0.3)
  Top 0.406: U$3.1- 147.4,32.11 v147.62,32.34
  Bottom 0.406: v147.62,32.34 147.85,32.57 U$10.8
N$26  (via drill 0.3)
  Top 0.305: v24.4,56.84 v7.4,56.84
  Bottom 0.305: R_DI_H.1 R_DI_L.2 25.3,56.84 v24.4,56.84 | v7.4,56.84 7.4,52.99 6,51.59 4.75,51.59 4.5,51.34 4.5,49.09 4.62,48.97 5.77,48.97 ST2.2
N$27
  Top 0.305: R37.1 156.55,58.67 U$14.B-
N$28  (via drill 0.3)
  Top 0.406: U$3.2+ 114.51,31.22 130.75,31.22 131.88,30.09 151.25,30.09 v151.62,30.47
  Bottom 0.406: v151.62,30.47 151.66,30.51 U$10.5
N$30
  Top 0.305: R36.1 155.45,57.27 U$14.G-
N$32
  Top 0.305: R35.1 154.35,55.74 U$14.R-
N$33
  Top 0.305: GR_BL_L.1 114.42,58.79 R1.2
N$34
  Top 0.305: GR_BLR.1 R4.2
N$35  (via drill 0.3)
  Top 0.305: 37.33,60.97 C_QUA_2.2 37.2,62.14 v36.25,63.09
  Bottom 0.305: IC4.33 46,55.97 41,60.97 35.88,60.97 | 35.88,60.97 35.76,60.97 16MHZ.2 | v36.25,63.09 36.25,61.34 35.88,60.97
N$36  (via drill 0.3)
  Top 0.305: C_QUA_1.2 45.7,60.29 v45,59.59
  Bottom 0.305: v45,59.59 45,60.96 16MHZ.1 46.5,59.46 IC4.34
N$37  (via drill 0.3)
  Top 0.305: C_REF.1 41.22,27.98 v41.25,27.95
  Bottom 0.305: IC4.98 43.5,30.2 v41.25,27.95
N$38
  Top 0.305: R5.2 RE_OIL.1
N$39
  Top 0.305: BL_HB.1 R6.2
N$40
  Top 0.305: IC1.10 46.2,35.64 46.5,35.34 54.02,35.34 R38.1
N$41  (via drill 0.3)
  Top 0.406: v149,33.72 148.88,33.84 132.25,33.84 130.75,32.34 118.9,32.34 U$3.2-
  Bottom 0.406: U$10.7 149,37.75 v149,33.72
N$42
  Top 0.305: R10.1 R42.1
N$43
  Bottom 0.305: U$10.19 144.04,54.03 C14.2 R_EC_L1.2
N$44  (via drill 0.3)
  Top 0.305: v145.62,31.09 150.38,31.09 150.75,31.47 155.62,31.47 v156,31.84
  Bottom 0.305: R_EC_L2.2 146.75,29.97 v145.62,31.09 | U$10.26 156.17,47.53 C15.2 156.25,32.09 v156,31.84
N$45
  Bottom 0.305: U$10.27 145.09,46.26 143.75,47.59 142.08,47.59 U$10.18 138.83,47.53 | 138.83,47.53 R_V_REF_H.2 C13.2 | 138.83,47.53 138.83,45.65 R_V_REF_L.2
N$47
  Bottom 0.305: RS1.2 R_EC_L1.1 138.77,56.11 138.75,56.09 138.12,56.09 137.79,55.76 137.79,34.58 138.15,34.22 144.62,34.22 145.31,34.91 U$10.10
N$48
  Bottom 0.305: U$10.6 150.4,32.49 149.12,31.22 149.12,30.08 R_EC_L2.1 RS2.2
N$49
  Bottom 0.305: U$10.22 147.85,54.45 147.88,54.47 148.61,54.47 C_RC.2
  Bottom 0.406: C_RC.2 R_RC.2
N$51
  Top 0.305: R12.1 136.25,71.59 136.75,72.09 U$15.R-
N$52
  Top 0.305: 134.99,73.47 R13.1 135.27,73.19 U$15.G-
N$53
  Top 0.305: R14.1 135.75,75.34 136.8,74.29 U$15.B-
N$54  (via drill 0.3)
  Top 0.305: 18632422.R- 91.62,54.57 91.62,53.72 91.75,53.59 93,53.59 95,55.59 109.5,55.59 110.75,54.34 126.62,54.34 v126.75,54.22
  Bottom 0.305: R18.1 126.5,54.47 v126.75,54.22
N$55  (via drill 0.3)
  Top 0.305: 18632422.G- 90.5,53.49 91.15,52.84 93.5,52.84 95.25,54.59 109.25,54.59 110.25,53.59 v117.62,53.59
  Bottom 0.305: v117.62,53.59 117.62,57.05 R19.1
N$56  (via drill 0.3)
  Top 0.305: 18632422.B- 89.4,52.94 90.25,52.09 94,52.09 95.5,53.59 108.75,53.59 109.5,52.84 119.75,52.84 v120.5,52.09
  Bottom 0.305: v120.5,52.09 120.5,66.26 R20.1
N$57
  Top 0.305: U$19.R- 115,7.59 116,8.59 R21.1
N$58
  Top 0.305: U$19.G- 117.28,6.49 R22.1
N$59
  Top 0.305: U$19.B- 115.2,5.39 116,4.59 R23.1
N$63  (via drill 0.3)
  Top 0.305: U$20.R- 122.03,43.82 v121.75,44.09
  Bottom 0.305: R24.1 121.4,44.44 v121.75,44.09
N$64  (via drill 0.3)
  Top 0.305: U$20.G- 123.12,43.72 v123.5,44.09
  Bottom 0.305: v123.5,44.09 123.4,44.19 R25.1
N$65  (via drill 0.3)
  Top 0.305: U$20.B- 124.22,42.82 v125.25,43.84
  Bottom 0.305: v125.25,43.84 125.65,44.24 R26.1
N$69
  Top 0.305: R27.2 GR_N.1
N$78
  Top 0.305: R_EXT4.1 17.5,30.09 18.75,31.34 21.75,31.34 22.5,32.09 22.5,33.09 23.49,34.08 X2.14
N$79
  Top 0.305: X2.13 R_EXT3.1 30.25,31.36 30.25,33.59 30.5,33.84 62,33.84 62,35.84 61.98,35.83 R39.1
N_IN  (via drill 0.3)
  Top 0.305: v26.25,26.34 26.5,26.59 48.25,26.59 51.75,30.09 59.25,30.09 60,30.84 74.75,30.84 v75.75,31.84 | v79.75,44.09 80,44.34 119.25,44.34 119.75,44.84 v129.5,44.84 | v129.5,59.59 R27.1
  Bottom 0.305: X2.10 26.25,25.68 v26.25,26.34 | v75.75,31.84 76,32.09 76,35.84 79,38.84 79,43.34 v79.75,44.09 | v129.5,44.84 v129.5,59.59
OIL_PRESSURE  (via drill 0.3)
  Top 0.305: v21.5,14.34 23,12.84 98.25,12.84 v99.25,11.84 | R5.1 108,51.34 v109,50.34 | v101.5,27.59 v111.38,27.59
  Bottom 0.305: X2.6 19.36,32.71 18.75,32.09 18.75,17.09 v21.5,14.34 | v99.25,11.84 100,11.84 102.25,14.09 102.25,23.59 100.75,25.09 100.75,26.84 v101.5,27.59 | v109,50.34 109,48.34 110.25,47.09 110.25,35.34 111.38,34.22 v111.38,27.59
P0
  Bottom 0.406: D3.1 R15.2
P1
  Bottom 0.406: D10.1 R16.2
P2
  Bottom 0.203: D11.1 103.46,66.33 103.46,65.06 R17.2
  Bottom 0.406: 103.99,66.57 103.99,65.49 R17.2
RED_INSTR  (via drill 0.3)
  Top 0.305: R29.2 v124,16.84 124,8.84 123.75,8.59 R21.2 | v122.25,75.59 R32.2 | R12.2 122.5,71.59 v122.25,71.34 | v124.5,52.84 127.88,52.84 129,53.97 150.75,53.97 151.38,54.59 151.38,58.63 R35.2
  Bottom 0.305: v124,16.84 124,21.09 127,24.09 127,52.84 v124.5,52.84 123,52.84 122.5,53.34 122.5,54.34 122.38,54.47 | v122.25,75.59 v122.25,71.34 122.25,54.47 | 122.38,54.47 122.25,54.47 | 122.38,54.47 R18.2 124,54.46 | 122.25,54.47 T3.3
REED  (via drill 0.3)
  Top 0.305: v38.5,16.34 38.25,16.09 20.5,16.09 18.75,17.84 14.25,17.84 13.12,18.97 13.12,23.97 14,24.84 | v61.75,20.84 v38.75,20.84 | IC1.12 48.74,37.1 49,36.84 61.75,36.84 v62,36.59 | 14,24.84 6.89,24.84 R42.2 | 14,24.84 R11.2
  Bottom 0.305: v61.75,20.84 62,21.09 v62,36.59 | v38.75,20.84 38.5,20.59 v38.5,16.34
REED_IN
  Top 0.305: X2.3 20.46,24.84 R11.1
RESETAVR_AT8
  Bottom 0.305: IC2.29 92.56,51.9 91.25,50.59 91.25,41.59 89.71,40.05 JP2.2
RX0  (via drill 0.3)
  Top 0.305: v82.25,17.84 v35.9,17.84
  Bottom 0.305: IC4.2 38.01,35.45 35.9,33.34 v35.9,17.84 | v82.25,17.84 82.28,17.81 RX.1
RX1  (via drill 0.3)
  Top 0.305: v53.65,55.34 88.5,55.34 89,55.84 94,55.84 94.75,56.59 109.75,56.59 111.25,55.09 115.12,55.09 v115.5,55.47 | GPS.TXD 152.35,28.37 152.12,28.59 127.62,28.59 v126,30.22 | v125.75,36.22 118.25,36.22 v118,36.47
  Bottom 0.305: IC4.45 52,53.69 v53.65,55.34 | v126,30.22 126,35.97 v125.75,36.22 | v118,36.47 118,44.09 115.75,46.34 115.75,55.22 v115.5,55.47
RX3  (via drill 0.3)
  Top 0.305: v76.15,38.59 75.9,38.34 59.15,38.34 v59.15,39.59 | v93.15,56.59 87.75,56.59 86.88,57.47 76.28,57.47 v76.15,57.37
  Bottom 0.305: IC2.31 93.76,53.48 93.15,54.09 v93.15,56.59 | v76.15,38.59 v76.15,57.37 | IC4.63 58.89,40.95 59.15,40.69 v59.15,39.59
SCK_AT8  (via drill 0.3)
  Top 0.305: v93,40.84 104.03,40.84 v104.15,40.97
  Bottom 0.305: IC2.17 103.36,46.39 104.15,45.59 v104.15,40.97 | JP2.4 92.25,40.09 v93,40.84
TO_DATA_LED  (via drill 0.3)
  Top 0.305: v96.5,58.72 106.38,58.72 107.88,60.22 115.5,60.22 v116.5,59.22
  Bottom 0.305: 115.9,26 BLUETOOTH.P$11 116,26.1 116,27.09 118.75,29.84 118.75,44.34 116.5,46.59 v116.5,59.22 | R_DATA.2 96.43,58.79 v96.5,58.72
TX  (via drill 0.3)
  Top 0.305: v87.5,24.59 87.75,24.84 v115.12,24.84
  Bottom 0.305: RX.2 84.83,21.92 v87.5,24.59 | BLUETOOTH.P$27 117.19,22.78 v115.12,24.84
TX0  (via drill 0.3)
  Top 0.305: v34.9,18.84 94.08,18.84 TX.2
  Bottom 0.305: 37.5,35.95 IC4.3 | 37.5,35.95 35,33.45 | 37.5,35.95 37.5,35.94 34.65,33.09 34.65,19.09 v34.9,18.84
TX1  (via drill 0.3)
  Top 0.305: v53.12,52.47 53.25,52.59 88.5,52.59 v89.12,51.97 88.62,52.47 | v93.38,25.84 v132.75,25.84
  Bottom 0.305: IC4.46 52.5,51.84 v53.12,52.47 | 89.38,51.72 v89.12,51.97 89.5,51.59 89.5,42.47 86.38,39.34 86.38,37.59 88.75,35.22 88.75,27.47 90.38,25.84 v93.38,25.84 | R41.2 136.88,21.72 v132.75,25.84
TX1_3.3  (via drill 0.3)
  Top 0.305: 153.88,26.42 GPS.RXD 153.85,24.24 v153.88,24.22
  Bottom 0.305: R41.1 142.75,21.72 | 142.75,21.72 R40.1 | 142.75,21.72 142.75,22.84 143.38,23.47 153.12,23.47 v153.88,24.22
TX3  (via drill 0.3)
  Top 0.305: v58.25,39.09 58.25,37.84 58.5,37.59 77.88,37.59 78.88,38.59 87.25,38.59 v87.38,38.72
  Bottom 0.305: IC4.64 58.15,40.45 58.25,40.35 v58.25,39.09 58.15,39.2 | IC2.30 96.24,52.72 92.12,52.72 90.38,50.97 90.38,41.72 v87.38,38.72
V_BAK
  Top 0.305: BAT_CLIP1.VCC@1 149.01,19.6 C7.1 144.85,23.76 GPS.VBACKUP
VDD  (via drill 0.3)
  Top 0.305: v41.25,30.45 39.23,30.45 C_ATM2.1 | C_ATM1.1 40.73,32.26 41.15,31.84 41.15,30.55 v41.25,30.45 | 51.15,41.09 51.28,40.96 IC1.14 | 43.65,41.09 50.15,41.09 | 50.15,41.09 51.15,41.09 | 50.15,41.09 50.01,40.96 IC1.13 | 51.15,41.09 v52.9,41.09 | v52.9,43.84 51.38,43.84 | 51.38,43.84 46.4,43.84 46.2,44.04 IC1.5 | 52.15,67.34 52.22,67.27 | 55.4,67.34 55.33,67.27 | v74.65,39.09 62.4,39.09 v62.15,39.34 | 49.15,67.34 49.03,67.22 | v45.65,30.34 41.36,30.34 v41.25,30.45 | v27.9,41.09 28.75,41.09 | 28.75,41.09 43.65,41.09 | v149.12,53.09 151.5,53.09 153.5,51.09 154.5,51.09 | 88.62,27.84 85.5,27.84 83.75,26.09 83.75,23.59 83.25,23.09 v79.25,23.09 78,24.34 55.5,24.34 53.25,22.09 v51.9,22.09 | 88.62,27.84 89.75,27.84 | 89.75,27.84 90,27.84 | 90,27.84 90.75,27.84 91.35,27.24 U$18.R+ | 90,27.84 90.03,27.82 | v105.5,72.34 105.5,72.97 | 105.5,72.97 105.5,73.97 | 105.5,73.97 105.5,74.34 106.25,75.09 U$16.R+ | 50,67.34 49.98,67.33 | 56.5,67.34 56.52,67.33 | v38.65,39.84 29.32,39.84 C_ATMEGA.1 28.72,39.31 28.75,39.34 | 29.15,39.84 29.15,39.74 28.75,39.34 | 28.75,41.09 28.75,39.34 | JP1.5 22.07,58.67 v22.15,58.59 23.43,58.59 R2.2 | 48.75,67.34 48.86,67.45 | 70.25,68.72 70.5,68.47 | 77,68.72 R_LED_5V.1 | IC1.1 51.28,43.93 51.38,43.84 | IC1.8 43.66,41.08 43.65,41.09 | v47.62,54.84 v43.75,54.84 | v92.5,60.09 91.5,60.09 | 91.5,60.09 90.62,60.09 | 90.62,60.09 89.75,60.09 89.4,59.74 18632422.B+ | 18632422.G+ 90.5,59.97 90.62,60.09 | 18632422.R+ 91.6,59.99 91.5,60.09 | U$16.G+ 105.53,73.99 105.5,73.97 | U$16.B+ 105.58,72.89 105.5,72.97 | U$15.R+ v142.25,72.09 142.25,73.09 142.15,73.19 | 142.15,73.19 U$15.G+ | U$15.B+ 141.8,74.29 142.25,73.84 142.25,73.29 142.15,73.19
  Top 0.305: 154.5,51.09 155.5,51.09 | 155.5,51.09 156.5,51.09 156.62,51.22 156.62,52.27 U$14.B+ | U$14.G+ 155.45,51.14 155.5,51.09 | U$14.R+ 154.35,51.24 154.5,51.09 | U$19.B+ 109.2,5.39 109,5.59 109,6.59 | 109,7.59 109,10.09 108.25,10.84 79.12,10.84 v79,10.97 | 109,7.59 109,6.59 | 109,7.59 U$19.R+ | U$19.G+ 109.1,6.49 109,6.59 | U$18.G+ 90.25,27.34 89.75,27.84 | U$18.B+ 89.15,27.32 88.62,27.84 | 124.12,37.34 123.12,37.34 | 123.12,37.34 122.12,37.34 | U$20.R+ 122.03,37.44 122.12,37.34 | 123.12,37.34 U$20.G+ | U$20.B+ 124.22,37.44 124.12,37.34 | 122.12,37.34 116,37.34 115.11,36.45 v102.23,36.45 JP2.5 | 124.12,37.34 129.5,37.34 v130,37.84 | v131.5,52.72 131.88,53.09 v136,53.09 v149.12,53.09 | 149.12,51.83 C12.1 v149.12,53.09 | v136,58.09 v146.75,58.09
  Top 0.61: v51.9,22.09 v45.65,22.09 v38.25,22.09 v27.9,22.09 | 108.4,68.34 v136,68.34 139.25,68.34 v140.25,67.34
  Top 1.016: 108.4,68.34 v105.75,68.34 v99.25,68.34 v92.5,68.34 81,68.34 80.9,68.44 | v25.4,67.34 v47.12,67.34 48.75,67.34 49.15,67.34 50,67.34 52.15,67.34 55.4,67.34 56.5,67.34 57.88,68.72 70.25,68.72 v72.62,68.72 77,68.72 80.62,68.72 80.9,68.44 | 80.9,68.44 5V_F.P$2
  Bottom 0.305: 102.73,42.34 R3.1 102.62,42.45 102.62,36.84 v102.23,36.45 | IC4.10 39.04,39.45 v38.65,39.84 | v52.9,41.09 v52.9,43.84 | IC4.80 52.5,22.94 v51.9,22.09 | R_OIL_V_DIV_2.2 38.31,22.15 v38.25,22.09 | 100.21,57.09 IC2.4 | IC2.6 101.78,57.06 101.75,57.09 100.21,57.09 | v99.25,68.34 99.25,60.34 99.48,60.11 C3.2 99.44,59.94 C2.2 99.44,57.4 99.75,57.09 100.21,57.09 | IC4.61 60.39,41.95 62.15,40.19 v62.15,39.34 | IC4.100 42.5,32.34 41.75,31.59 41.75,30.95 v41.25,30.45 | v92.5,68.34 v92.5,60.09 | v105.5,72.34 105.5,68.59 v105.75,68.34 | v72.62,68.72 72.62,63.84 74.9,61.57 74.9,39.34 v74.65,39.09 74.65,36.98 SDA_UP.1 R_SCL_UP.1 | IC4.31 45,53.59 v43.75,54.84 | v47.62,54.84 47.62,66.84 v47.12,67.34 | v79,10.97 79,22.84 v79.25,23.09 | v140.25,67.34 140.25,70.09 v142.25,72.09 | v130,37.84 130,41.97 131.25,43.22 131.25,52.47 v131.5,52.72 | R_V_REF_H.1 135.38,47.59 135.38,52.47 v136,53.09 v136,58.09 v136,68.34 | v149.12,53.09 U$10.23 | v146.75,58.09 R_RC.1
  Bottom 0.61: v45.65,22.09 v45.65,30.34 | v27.9,22.09 v27.9,41.09 27.9,48.09 27.15,48.84 23.15,48.84 22.15,49.84 v22.15,58.59 22.15,65.49 24,67.34 v25.4,67.34

## Text on the board
Top: JKW 11.2011 | Speedoino v4
tDocu: 15 | 1